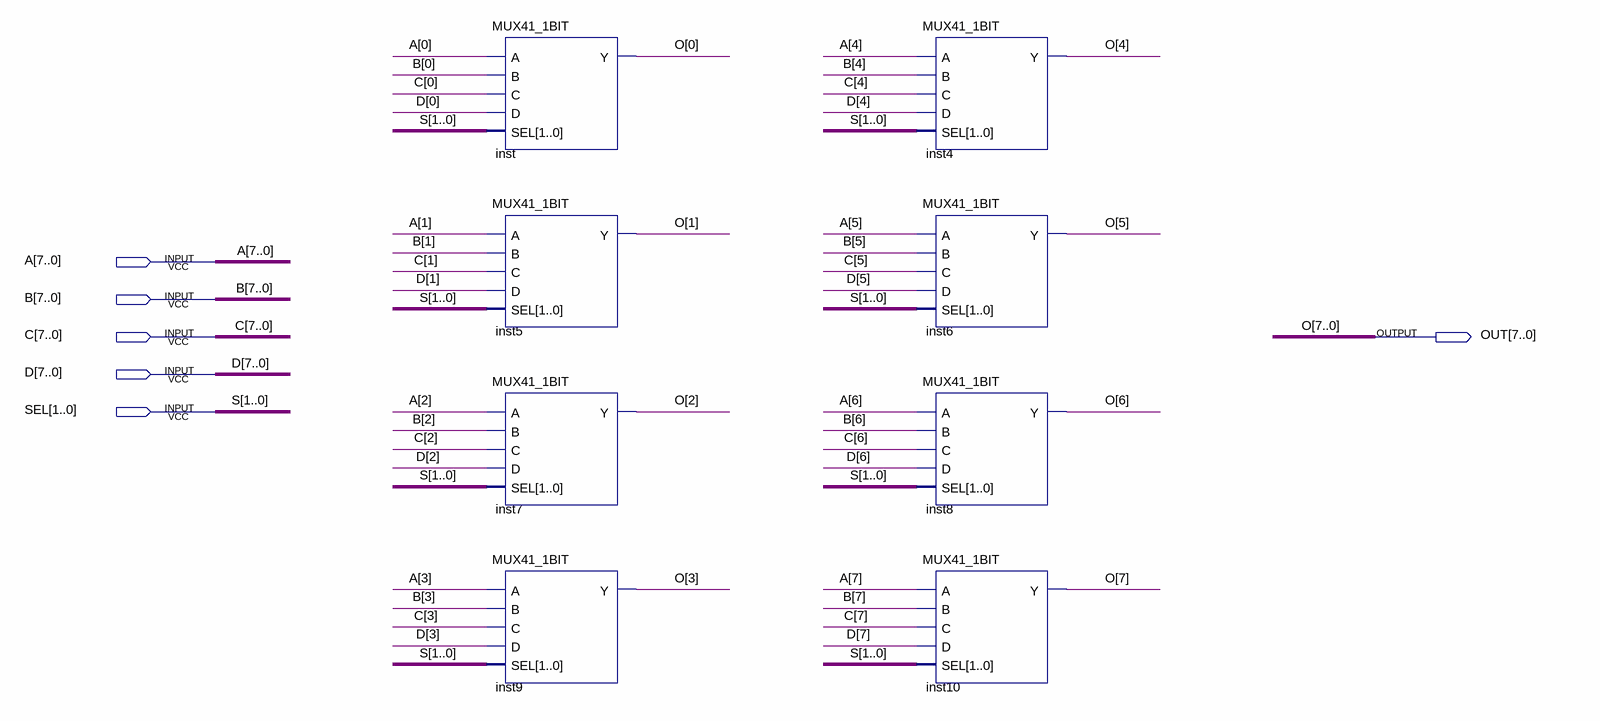
[diagram p0: schematic sheet]
// Quartus schematic MUX41_8BIT.bdf as structural Verilog: 8 symbols, 6 pins
module MUX41_8BIT (
  input  [7:0] A,
  input  [7:0] B,
  input  [7:0] C,
  input  [7:0] D,
  input  [1:0] SEL,
  output [7:0] OUT
);

  MUX41_1BIT inst (.A(A[0]), .B(B[0]), .C(C[0]), .D(D[0]), .SEL(SEL), .Y(OUT[0]));
  MUX41_1BIT inst5 (.A(A[1]), .B(B[1]), .C(C[1]), .D(D[1]), .SEL(SEL), .Y(OUT[1]));
  MUX41_1BIT inst7 (.A(A[2]), .B(B[2]), .C(C[2]), .D(D[2]), .SEL(SEL), .Y(OUT[2]));
  MUX41_1BIT inst9 (.A(A[3]), .B(B[3]), .C(C[3]), .D(D[3]), .SEL(SEL), .Y(OUT[3]));
  MUX41_1BIT inst4 (.A(A[4]), .B(B[4]), .C(C[4]), .D(D[4]), .SEL(SEL), .Y(OUT[4]));
  MUX41_1BIT inst6 (.A(A[5]), .B(B[5]), .C(C[5]), .D(D[5]), .SEL(SEL), .Y(OUT[5]));
  MUX41_1BIT inst8 (.A(A[6]), .B(B[6]), .C(C[6]), .D(D[6]), .SEL(SEL), .Y(OUT[6]));
  MUX41_1BIT inst10 (.A(A[7]), .B(B[7]), .C(C[7]), .D(D[7]), .SEL(SEL), .Y(OUT[7]));

  // Other names for the same wires on the sheet: O[7:0] = OUT; S[1:0] = SEL
endmodule
